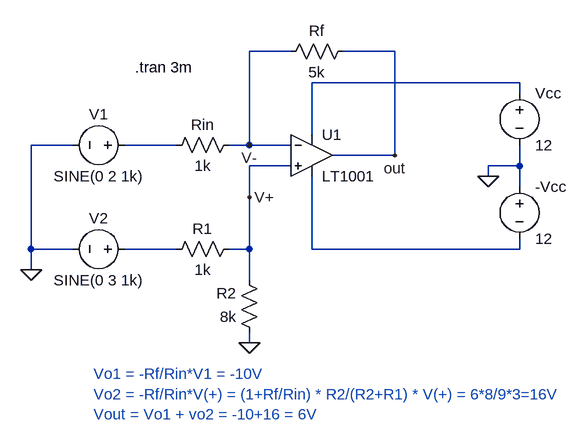
[diagram p0: schematic differential_amplifier.asc]
differential_amplifier.asc, the LTspice schematic file:
Version 4.1
SHEET 1 880 680
WIRE 144 0 80 0
WIRE 304 0 224 0
WIRE 496 48 176 48
WIRE 496 64 496 48
WIRE 176 128 176 48
WIRE -192 144 -256 144
WIRE -32 144 -112 144
WIRE 80 144 80 0
WIRE 80 144 48 144
WIRE 144 144 80 144
WIRE 304 160 304 0
WIRE 304 160 208 160
WIRE 144 176 80 176
WIRE 496 176 496 144
WIRE 496 176 448 176
WIRE 448 192 448 176
WIRE 496 208 496 176
WIRE 80 224 80 176
WIRE -256 304 -256 144
WIRE -192 304 -256 304
WIRE -32 304 -112 304
WIRE 80 304 80 224
WIRE 80 304 48 304
WIRE 176 304 176 192
WIRE 496 304 496 288
WIRE 496 304 176 304
WIRE -256 336 -256 304
WIRE 80 352 80 304
WIRE 80 448 80 432
FLAG 448 192 0
FLAG -256 336 0
FLAG 80 448 0
FLAG 80 144 V-
FLAG 80 224 V+
FLAG 304 160 out
SYMBOL OpAmps\\LT1001 176 96 R0
SYMATTR InstName U1
SYMBOL voltage 496 48 R0
WINDOW 123 0 0 Left 0
WINDOW 39 0 0 Left 0
SYMATTR InstName Vcc
SYMATTR Value 12
SYMBOL voltage 496 192 R0
WINDOW 123 0 0 Left 0
WINDOW 39 0 0 Left 0
SYMATTR InstName -Vcc
SYMATTR Value 12
SYMBOL res 64 128 R90
WINDOW 0 0 56 VBottom 2
WINDOW 3 32 56 VTop 2
SYMATTR InstName Rin
SYMATTR Value 1k
SYMBOL res 240 -16 R90
WINDOW 0 0 56 VBottom 2
WINDOW 3 32 56 VTop 2
SYMATTR InstName Rf
SYMATTR Value 5k
SYMBOL voltage -96 144 R90
WINDOW 0 -32 56 VBottom 2
WINDOW 3 32 56 VTop 2
WINDOW 123 0 0 Left 0
WINDOW 39 0 0 Left 0
SYMATTR InstName V1
SYMATTR Value SINE(0 2 1k)
SYMBOL voltage -96 304 R90
WINDOW 0 -32 56 VBottom 2
WINDOW 3 32 56 VTop 2
WINDOW 123 0 0 Left 0
WINDOW 39 0 0 Left 0
SYMATTR InstName V2
SYMATTR Value SINE(0 3 1k)
SYMBOL res 64 288 R90
WINDOW 0 0 56 VBottom 2
WINDOW 3 32 56 VTop 2
SYMATTR InstName R1
SYMATTR Value 1k
SYMBOL res 96 448 R180
WINDOW 0 36 76 Left 2
WINDOW 3 36 40 Left 2
SYMATTR InstName R2
SYMATTR Value 8k
TEXT -96 24 Left 2 !.tran 3m
TEXT -160 496 Left 2 ;Vo1 = -Rf/Rin*V1 = -10V\nVo2 = -Rf/Rin*V(+) = (1+Rf/Rin) * R2/(R2+R1) * V(+) = 6*8/9*3=16V\nVout = Vo1 + vo2 = -10+16 = 6V

The netlist it stands for:
* differential_amplifier.asc
X§U1 V+ V- N001 N004 out LT1001  ; pins In+ In- V+ V- OUT
Vcc N001 0 12
V§-Vcc 0 N004 12
Rin V- N002 1k
Rf out V- 5k
V1 N002 0 SINE(0 2 1k)
V2 N003 0 SINE(0 3 1k)
R1 V+ N003 1k
R2 0 V+ 8k
.tran 3m
* Vo1 = -Rf/Rin*V1 = -10V
* Vo2 = -Rf/Rin*V(+) = (1+Rf/Rin) * R2/(R2+R1) * V(+) = 6*8/9*3=16V
* Vout = Vo1 + vo2 = -10+16 = 6V
.lib LTC.lib
.backanno
.end